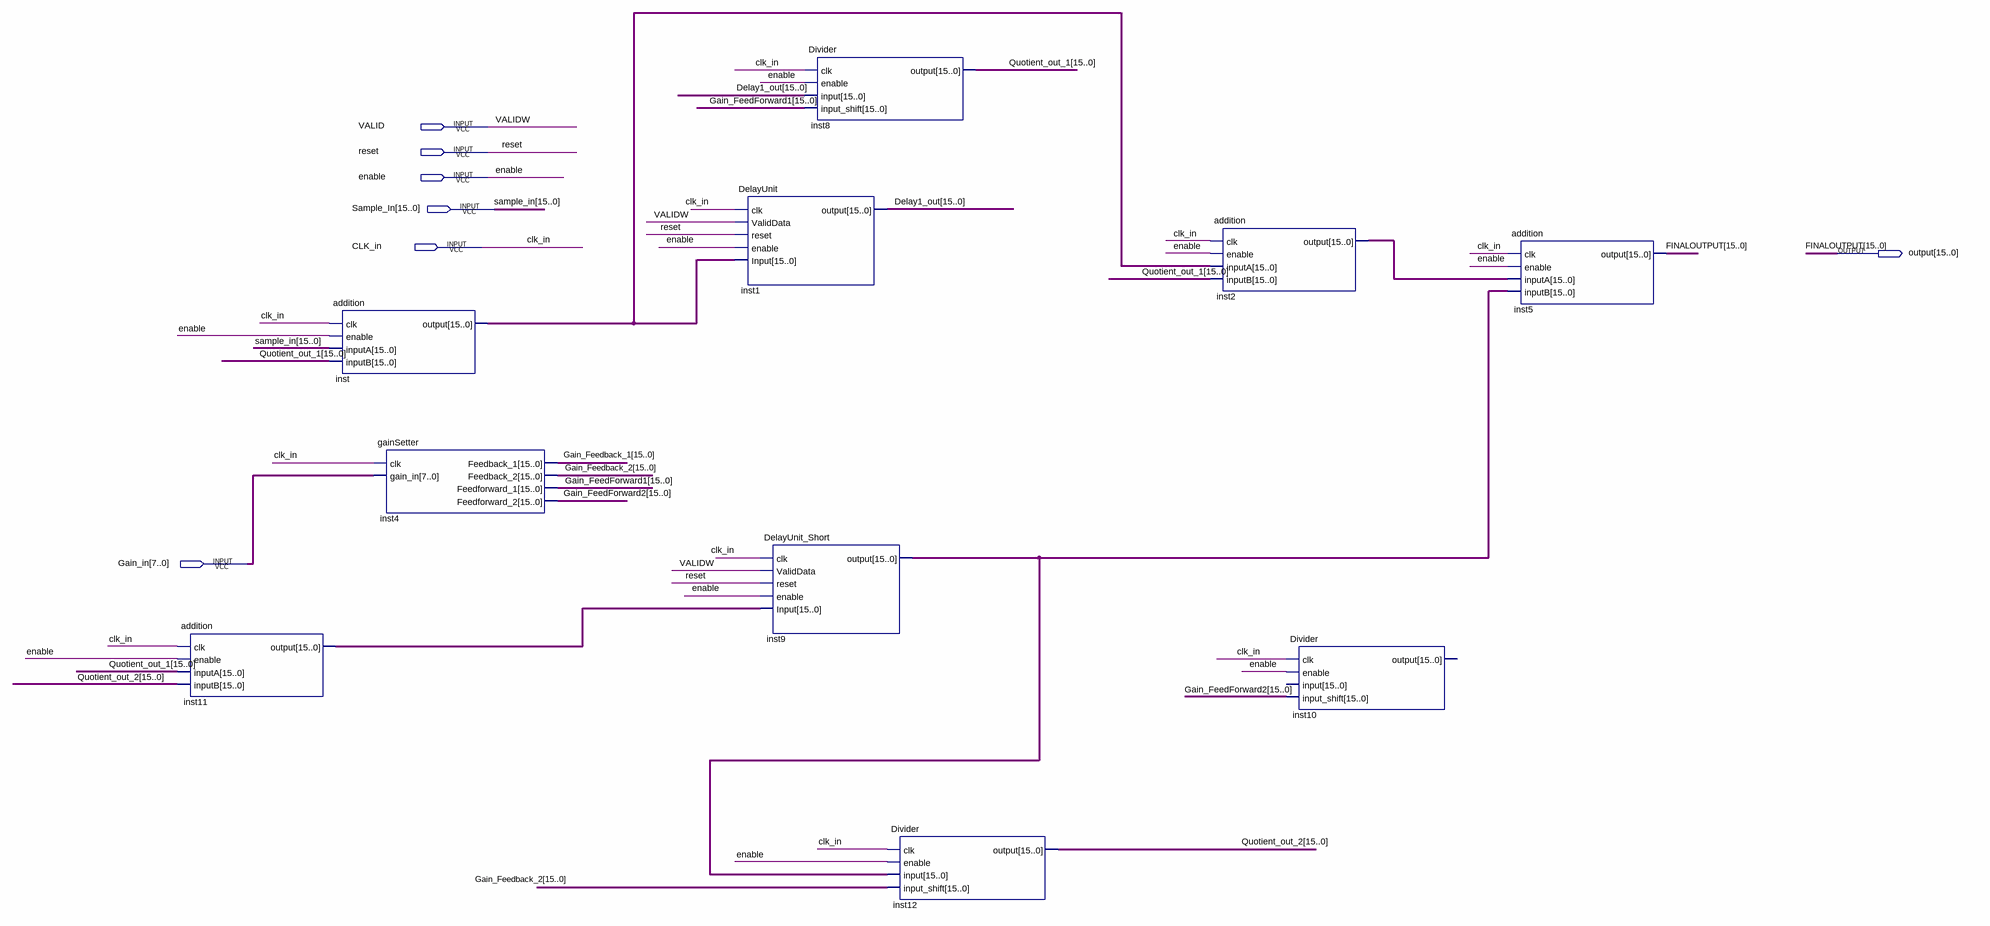
[diagram p0: schematic sheet]
// Quartus schematic ComplexEcho.bdf as structural Verilog: 10 symbols, 7 pins
module ComplexEcho (
  input  VALID,
  input  reset,
  input  enable,
  input  [15:0] Sample_In,
  input  CLK_in,
  input  [7:0] Gain_in,
  output [15:0] \output 
);

  wire [15:0] Delay1_out, Gain_Feedback_1, Gain_Feedback_2, Gain_FeedForward1, Gain_FeedForward2,
       inst2_output, inst9_output, inst11_output, inst_output, Quotient_out_1, Quotient_out_2;

  addition inst11 (
    .clk(CLK_in), .enable(enable), .inputA(Quotient_out_1), .inputB(Quotient_out_2), .\output (inst11_output));
  addition inst (.clk(CLK_in), .enable(enable), .inputA(Sample_In), .inputB(Quotient_out_1), .\output (inst_output));
  gainSetter inst4 (
    .clk(CLK_in), .gain_in(Gain_in), .Feedback_1(Gain_Feedback_1), .Feedback_2(Gain_Feedback_2),
    .Feedforward_1(Gain_FeedForward1), .Feedforward_2(Gain_FeedForward2));
  DelayUnit inst1 (
    .clk(CLK_in), .ValidData(VALID), .reset(reset), .enable(enable), .Input(inst_output),
    .\output (Delay1_out));
  Divider inst8 (
    .clk(CLK_in), .enable(enable), .\input (Delay1_out), .input_shift(Gain_FeedForward1),
    .\output (Quotient_out_1));
  DelayUnit_Short inst9 (
    .clk(CLK_in), .ValidData(VALID), .reset(reset), .enable(enable), .Input(inst11_output),
    .\output (inst9_output));
  Divider inst12 (
    .clk(CLK_in), .enable(enable), .\input (inst9_output), .input_shift(Gain_Feedback_2),
    .\output (Quotient_out_2));
  addition inst2 (
    .clk(CLK_in), .enable(enable), .inputA(inst_output), .inputB(Quotient_out_1), .\output (inst2_output));
  Divider inst10 (.clk(CLK_in), .enable(enable), .input_shift(Gain_FeedForward2));  // open: input, output
  addition inst5 (.clk(CLK_in), .enable(enable), .inputA(inst2_output), .inputB(inst9_output), .\output (\output ));

  // Other names for the same wires on the sheet: FINALOUTPUT[15:0] = \output ; VALIDW = VALID
endmodule
